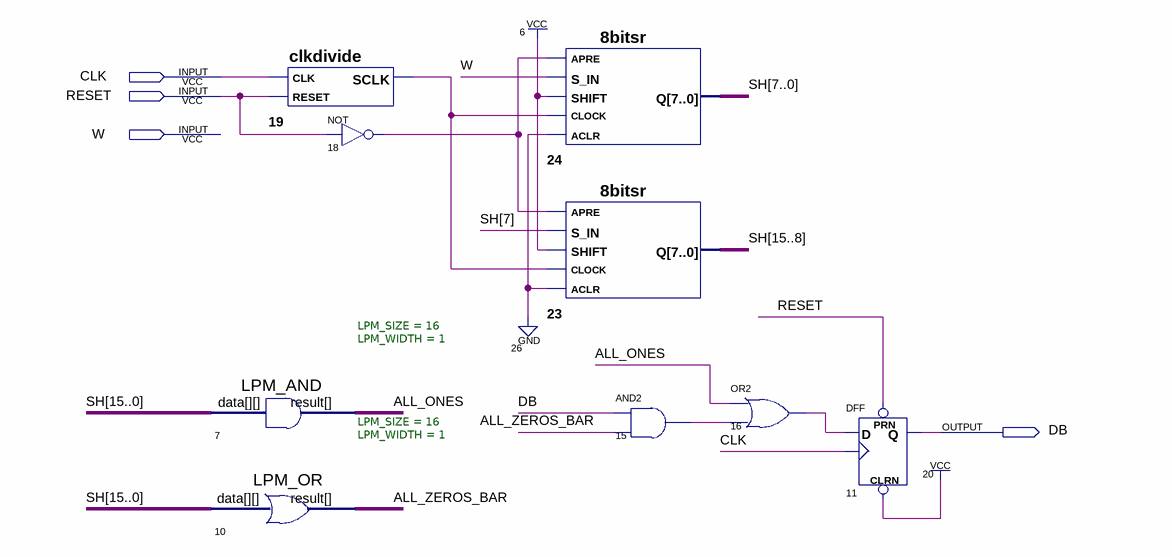
[diagram p0: schematic sheet]
// Quartus schematic debounce_rh.bdf as structural Verilog: 9 symbols, 4 pins
module debounce_rh (
  input  CLK,
  input  RESET,
  input  W,
  output DB
);

  wire ALL_ONES, ALL_ZEROS_BAR, n15_out, n16_out, n18_out, n19_sclk;
  wire [15:0] SH;

  LPM_AND #(.LPM_SIZE(16), .LPM_WIDTH(1)) u_7 (.data(SH), .result(ALL_ONES));
  LPM_OR #(.LPM_SIZE(16), .LPM_WIDTH(1)) u_10 (.data(SH), .result(ALL_ZEROS_BAR));
  clkdivide u_19 (.CLK(CLK), .RESET(RESET), .SCLK(n19_sclk));
  not u_18 (n18_out, RESET);
  \8bitsr  u_24 (.APRE(n18_out), .S_IN(W), .SHIFT(1'b1), .CLOCK(n19_sclk), .ACLR(1'b0), .Q(SH[7:0]));
  \8bitsr  u_23 (.APRE(n18_out), .S_IN(SH[7]), .SHIFT(1'b1), .CLOCK(n19_sclk), .ACLR(1'b0), .Q(SH[15:8]));
  and u_15 (n15_out, DB, ALL_ZEROS_BAR);
  or u_16 (n16_out, ALL_ONES, n15_out);
  DFF u_11 (.CLRN(1'b1), .CLK(CLK), .D(n16_out), .PRN(RESET), .Q(DB));
endmodule
